# Altium schematic sheet NH1-1-Top.SchDoc: Top
size A3; SheetNumber: 1; SheetTotal: 1
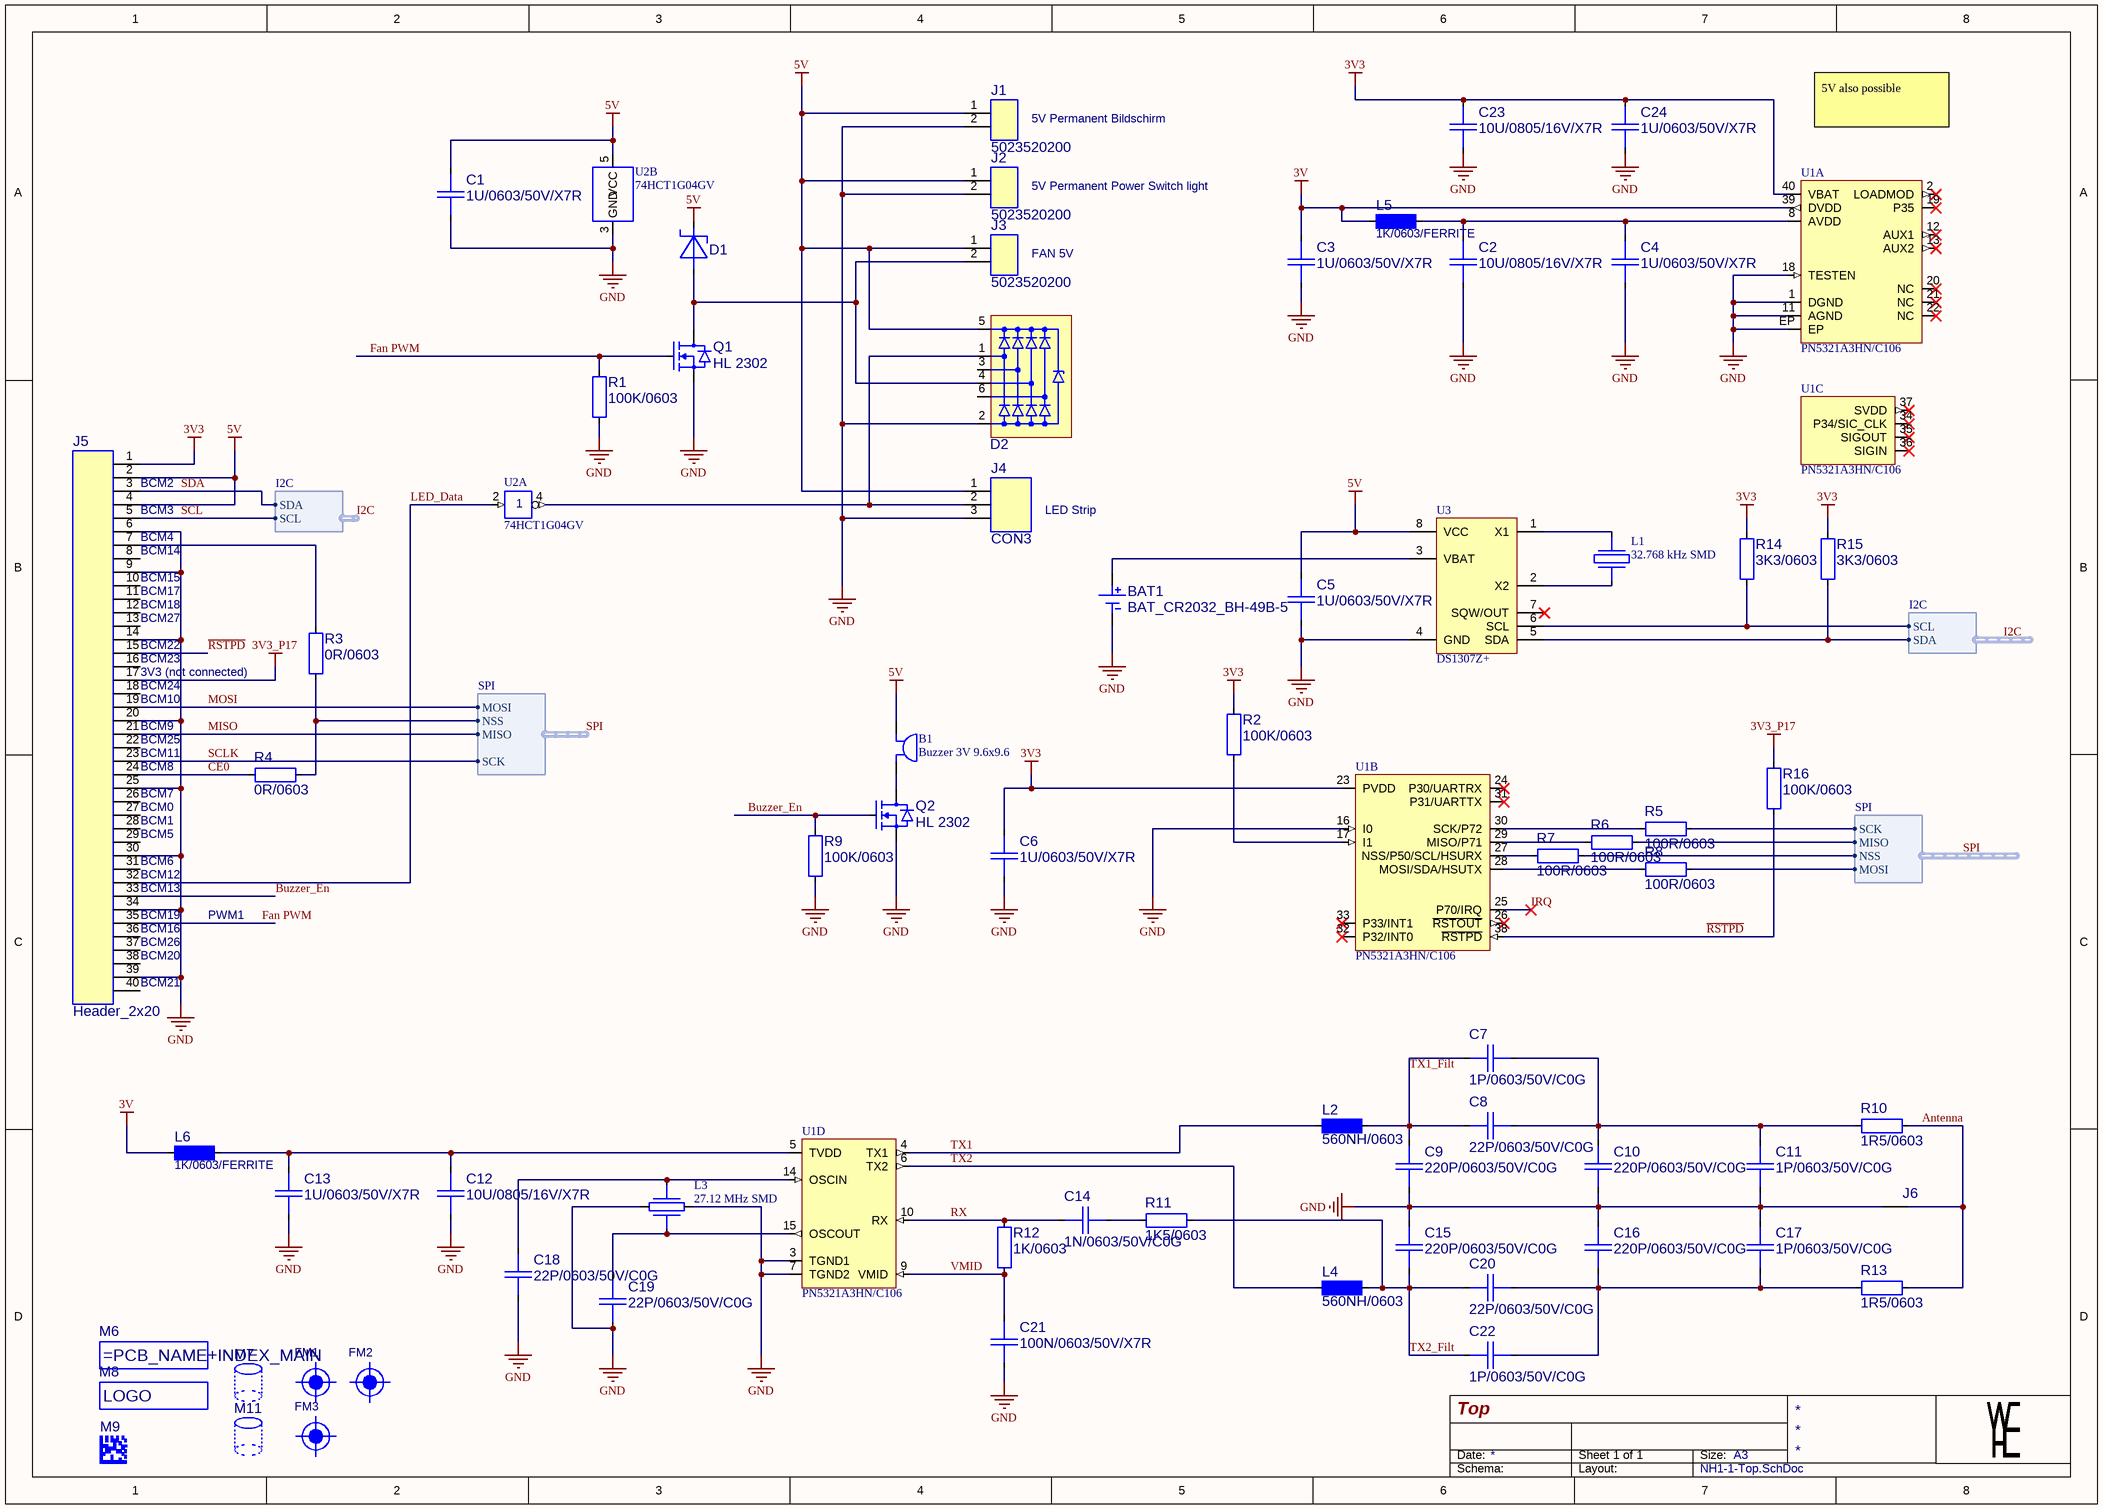
[diagram p0: NH1-1-Top.SchDoc]

## Parts
B1  Buzzer 3V 9.6x9.6  [BUZ970X970X500]
BAT1  BAT_CR2032_BH-49B-5  [BAT_CR2032_BH-49B-5]
C1  1U/0603/50V/X7R  [CAP0603_X7R]
C2  10U/0805/16V/X7R  [CAP0805_X7R]
C3  1U/0603/50V/X7R  [CAP0603_X7R]
C4  1U/0603/50V/X7R  [CAP0603_X7R]
C5  1U/0603/50V/X7R  [CAP0603_X7R]
C6  1U/0603/50V/X7R  [CAP0603_X7R]
C7  1P/0603/50V/C0G  [CAP0603_C0G]
C8  22P/0603/50V/C0G  [CAP0603_C0G]
C9  220P/0603/50V/C0G  [CAP0603_C0G]
C10  220P/0603/50V/C0G  [CAP0603_C0G]
C11  1P/0603/50V/C0G  [CAP0603_C0G]
C12  10U/0805/16V/X7R  [CAP0805_X7R]
C13  1U/0603/50V/X7R  [CAP0603_X7R]
C14  1N/0603/50V/C0G  [CAP0603_C0G]
C15  220P/0603/50V/C0G  [CAP0603_C0G]
C16  220P/0603/50V/C0G  [CAP0603_C0G]
C17  1P/0603/50V/C0G  [CAP0603_C0G]
C18  22P/0603/50V/C0G  [CAP0603_C0G]
C19  22P/0603/50V/C0G  [CAP0603_C0G]
C20  22P/0603/50V/C0G  [CAP0603_C0G]
C21  100N/0603/50V/X7R  [CAP0603_X7R]
C22  1P/0603/50V/C0G  [CAP0603_C0G]
C23  10U/0805/16V/X7R  [CAP0805_X7R]
C24  1U/0603/50V/X7R  [CAP0603_X7R]
D1  B5819W SL  [SOD3718X125]  (value not drawn)
D2  PRTR5V0U4D  [SOT2395P280X125-6-NW]  (value not drawn)
FM1  Fidu  [FIDU-1MM]  (value not drawn)  (no BOM)
FM2  Fidu  [FIDU-1MM]  (value not drawn)  (no BOM)
FM3  Fidu  [FIDU-1MM]  (value not drawn)  (no BOM)
J1  5023520200  [5023520200]
J2  5023520200  [5023520200]
J3  5023520200  [5023520200]
J4  CON3  [5023520300]
J5  Header_2x20  [HEAD_254_2X20]
J6  NETTIE_025x050  [NETTIE_025x050]  (value not drawn)  (no BOM)
L1  32.768 kHz SMD  [CYSMD550P380X800X254]
L2  560NH/0603  [IND0603]
L3  27.12 MHz SMD  [CYSMD220P340X270X080]
L4  560NH/0603  [IND0603]
L5  1K/0603/FERRITE  [FB0603]
L6  1K/0603/FERRITE  [FB0603]
M6  PCB NAME  [PCB-NAME-5MM-LEFT]  (value not drawn)
M7  Tooling JLC  [TOOLING-JLC]  (value not drawn)
M8  LOGO WHE  [LOGO-WHE-20MM]  (value not drawn)
M9  SERIAL 2D  [SERIAL-2D-10MM-RESTRICT]  (value not drawn)
M11  Tooling JLC  [TOOLING-JLC]  (value not drawn)
Q1  HL 2302  [SOT2395P280X125-3-SE]
Q2  HL 2302  [SOT2395P280X125-3-SE]
R1  100K/0603  [R0603-0.40-WW]
R2  100K/0603  [R0603-0.40-WW]
R3  0R/0603  [R0603-0.40-WW]
R4  0R/0603  [R0603-0.40-WW]
R5  100R/0603  [R0603-0.40-WW]
R6  100R/0603  [R0603-0.40-WW]
R7  100R/0603  [R0603-0.40-WW]
R8  100R/0603  [R0603-0.40-WW]
R9  100K/0603  [R0603-0.40-WW]
R10  1R5/0603  [R0603-0.40-WW]
R11  1K5/0603  [R0603-0.40-WW]
R12  1K/0603  [R0603-0.40-WW]
R13  1R5/0603  [R0603-0.40-WW]
R14  3K3/0603  [R0603-0.40-WW]
R15  3K3/0603  [R0603-0.40-WW]
R16  100K/0603  [R0603-0.40-WW]
U1  PN5321A3HN/C106  [QFN050P600X600X085-40-TH410X410]  (parts A,B,C,D of 4)
U2  74HCT1G04GV  [SOT2395P280X125-5-NW]  (parts A,B of 2)
U3  DS1307Z+  [SOP127P600X155-8-NW]

## Harnesses
SPI: SCK, MISO, NSS, MOSI
I2C: SCL, SDA

## Nets
3V: C3.1 L5.1 L6.1 U1.39(DVDD)
3V3: C6.1 C23.2 C24.1 J5.1 R2.1 R14.1 R15.1 U1.23(PVDD) U1.40(VBAT)
3V3_P17: J5.17 R16.1
5V: B1.1(+) C1.1 C5.1 D1.1(C) D2.5 J1.1 J2.1 J3.1 J4.1 J5.2 J5.4 U2.5(VCC) U3.8(VCC)
GND: BAT1.2(-) C1.2 C2.2 C3.2 C4.2 C5.2 C6.2 C9.2 C10.1 C11.1 C12.2 C13.2 C15.1 C16.2 C17.2 C18.2 C19.2 C21.2 C23.1 C24.2 D2.2 J1.2 J2.2 J4.3 J5.6 J5.9 J5.14 J5.20 J5.25 J5.30 J5.34 J5.39 J6.2 L3.2(GND) L3.4(GND) Q1.2(SOURCE) Q2.2(SOURCE) R1.2 R9.2 U1.1(DGND) U1.3(TGND1) U1.7(TGND2) U1.11(AGND) U1.16(I0) U1.18(TESTEN) U1.EP U2.3(GND) U3.4(GND)
Antenna: J6.1 R10.2 R13.2
Buzzer_En: J5.33 Q2.1(GATE) R9.1
CE0: J5.24 R4.1
Fan PWM: J5.35 Q1.1(GATE) R1.1
IRQ: U1.25(P70/IRQ)
LED_Data: J5.32 U2.2(A)
MISO: J5.21 R6.2 ; harness SPI.MISO
MOSI: J5.19 R8.2 ; harness SPI.MOSI
~{RSTPD}: J5.15 R16.2 U1.38(~{RSTPD})
RX: C14.1 R12.1 U1.10(RX)
SCL: J5.5 R14.2 U3.6(SCL) ; harness I2C.SCL  [project net I2C.SCL]
SCLK: J5.23 R5.2 ; harness SPI.SCK
SDA: J5.3 R15.2 U3.5(SDA) ; harness I2C.SDA  [project net I2C.SDA]
SPI.NSS: R3.1 R4.2 R7.2 ; harness SPI.NSS
TX1: L2.1 U1.4(TX1)
TX1_Filt: C7.1 C8.1 C9.1 L2.2
TX2: L4.1 U1.6(TX2)
TX2_Filt: C15.2 C20.1 C22.1 L4.2 R11.1
VMID: C21.1 R12.2 U1.9(VMID)
NetB1_2: B1.2(-) Q2.3(DRAIN)
NetBAT1_1: BAT1.1(+) U3.3(VBAT)
NetC2_1: C2.1 C4.1 L5.2 U1.8(AVDD)
NetC7_2: C7.2 C8.2 C10.2 C11.2 R10.1
NetC12_1: C12.1 C13.1 L6.2 U1.5(TVDD)
NetC14_2: C14.2 R11.2
NetC16_1: C16.1 C17.1 C20.2 C22.2 R13.1
NetC18_1: C18.1 L3.1 U1.14(OSCIN)
NetC19_1: C19.1 L3.3 U1.15(OSCOUT)
NetD1_2: D1.2(A) D2.4 J3.2 Q1.3(DRAIN)
NetD2_1: D2.1 J4.2 U2.4(Y)
NetJ5_7: J5.7 R3.2
NetL1_1: L1.1 U3.1(X1)
NetL1_4: L1.4 U3.2(X2)
NetR2_2: R2.2 U1.17(I1)
NetR5_1: R5.1 U1.30(SCK/P72)
NetR6_1: R6.1 U1.29(MISO/P71)
NetR7_1: R7.1 U1.27(NSS/P50/SCL/HSURX)
NetR8_1: R8.1 U1.28(MOSI/SDA/HSUTX)

Not connected (* = marked no-connect by the designer): D2 3 6; J5 8 10 11 12 13 16 18 22 26 27 28 29 31 36 37 38 40; U1 2(LOADMOD)* 12(AUX1)* 13(AUX2)* 19(P35)* 20(NC)* 21(NC)* 22(NC)* 24(P30/UARTRX)* 26(~{RSTOUT})* 31(P31/UARTTX)* 32(P32/INT0)* 33(P33/INT1)* 34(P34/SIC_CLK)* 35(SIGOUT)* 36(SIGIN)* 37(SVDD)*; U3 7(SQW/OUT)*

## Notes on the sheet
- (near J1) 5V Permanent Bildschirm
- 5V also possible
- (near J2) 5V Permanent Power Switch light
- (near J3) FAN 5V
- (near J5) BCM2
- (near J5) BCM3
- LED Strip
- (near J5) BCM4
- (near J5) BCM14
- (near J5) BCM15
- (near J5) BCM17
- (near J5) BCM18
- (near J5) BCM22
- (near J5) BCM27
- (near J5) BCM10
- (near J5) BCM23
- (near J5) BCM24
- (near J5) 3V3 (not connected)
- (near J5) BCM8
- (near J5) BCM9
- (near J5) BCM11
- (near J5) BCM25
- (near J5) BCM5
- (near J5) BCM7
- (near J5) BCM0
- (near J5) BCM1
- (near J5) BCM6
- (near J5) BCM12
- (near J5) BCM13
- (near J5) BCM19
- PWM1
- (near J5) BCM16
- (near J5) BCM20
- (near J5) BCM21
- (near J5) BCM26
- Date:
- Size:
- A3
- Schema:
- Layout:
- (in symbol 74HCT1G04GV, part A) 1

## Library data of the parts
B1 = Buzzer SMD: Buzzer Active 3V SMD; Manufacturer: Same Sky (Formerly CUI Devices); Manufacturer Part Number 1: CMI-9705-0380-SMT-TR; Part Number: Buzzer SMD; Manufacturer 1: Same Sky (Formerly CUI Devices); Supplier 1: Digi-Key; Supplier Part Number 1: 102-CMI-9705-0380-SMT-CT-ND; Manufacturer 3: FUET; Manufacturer Part Number 3: FUET FUET-9650B-3V; Supplier 3: LCSC; Supplier Part Number 3: C391032; HelpURL: https://www.sameskydevices.com/product/resource/cmi-9705-0380-smt-tr.pdf
BAT1 = BAT_CR2032_BH-49B-5: BH-49B-5 CR2032 Battery Holder; Manufacturer: Generic; Manufacturer 1: Adam Tech; Part Number: BAT_CR2032_BH-49B-5; HelpURL: https://app.adam-tech.com/products/download/data_sheet/197073/bh-49b-5-data-sheet.pdf; Manufacturer Part Number 1: BH-49B-5; Supplier 1: Digi-Key; Supplier Part Number 1: 2057-BH-49B-5-ND; Manufacturer 3: Lian Xin Technology; Manufacturer Part Number 3: XDCR-2032-603; Supplier 3: LCSC; Supplier Part Number 3: C7498148
C1 C3-C6 C13 C24 = 1U/0603/50V/X7R: CAP SM 0603 1.0uF 50V X7R; Manufacturer: GENERIC; Manufacturer 1: YAGEO; Manufacturer Part Number 1: CC0603KRX7R9BB105; Absolute Value: 1E-6; Eurocircuits GPN: GPC0603105; Part Number: 1U/0603/50V/X7R; Package: 0603; Value: 1.0uF; HelpURL: https://www.yageo.com/upload/media/product/app/datasheet/mlcc/upy-gphc_x7r_6_3v-to-250v.pdf; Supplier 1: Digi-Key; Supplier Part Number 1: 311-2082-1-ND
C2 C12 C23 = 10U/0805/16V/X7R: CAP SM 0805 10uF 16V X7R; Manufacturer: GENERIC; Manufacturer 1: Cal-Chip Electronics, Inc.; Manufacturer Part Number 1: GMC21X7R106K16NT; Absolute Value: 1E-5; Eurocircuits GPN: GPN0805106-16; Part Number: 10U/0805/16V/X7R; Package: 0805; Value: 10uF; HelpURL: https://88ce57.p3cdn1.secureserver.net/wp-content/uploads/2023/01/gmc_series-2.pdf; Supplier 1: Digi-Key; Supplier Part Number 1: 4713-GMC21X7R106K16NTCT-ND; Manufacturer 2: Samsung Electro-Mechanics; Manufacturer Part Number 2: CL21B106KOQNNNE; Supplier 2: Digi-Key; Supplier Part Number 2: 1276-2872-1-ND; Supplier 3: LCSC; Supplier Part Number 3: C95841; JLC Type: Basic
C7 C11 C17 C22 = 1P/0603/50V/C0G: CAP SM 0603 1.0pF 50V C0G; Manufacturer: GENERIC; Manufacturer 1: YAGEO; Manufacturer Part Number 1: CC0603CRNPO9BN1R0; Absolute Value: 1E-12; Eurocircuits GPN: GPC06031R0-C0G; Part Number: 1P/0603/50V/C0G; Package: 0603; Value: 1.0pF; HelpURL: https://www.yageo.com/upload/media/product/productsearch/datasheet/mlcc/UPY-GP_NP0_16V-to-50V_18.pdf; Supplier 1: Digi-Key; Supplier Part Number 1: 311-1049-1-ND; Manufacturer 2: YAGEO; Manufacturer Part Number 2: CC0603BRNPO9BN1R0; Supplier 2: Digi-Key; Supplier Part Number 2: 311-3346-1-ND
C8 C18-C20 = 22P/0603/50V/C0G: CAP SM 0603 22pF 50V C0G; Manufacturer: GENERIC; Manufacturer 1: YAGEO; Manufacturer Part Number 1: CC0603JRNPO9BN220; Absolute Value: 2.2E-11; Eurocircuits GPN: GPC0603220-C0G; Part Number: 22P/0603/50V/C0G; Package: 0603; Value: 22pF; HelpURL: https://www.yageo.com/upload/media/product/productsearch/datasheet/mlcc/UPY-GP_NP0_16V-to-50V_18.pdf; Supplier 1: Digi-Key; Supplier Part Number 1: 311-1062-1-ND; Manufacturer 2: YAGEO; Manufacturer Part Number 2: CC0603KRNPO9BN220; Supplier 2: Digi-Key; Supplier Part Number 2: 311-4030-1-ND
C9 C10 C15 C16 = 220P/0603/50V/C0G: CAP SM 0603 220pF 50V C0G; Manufacturer: GENERIC; Manufacturer 1: YAGEO; Manufacturer Part Number 1: CC0603JRNPO9BN221; Absolute Value: 2.2E-10; Eurocircuits GPN: GPC0603221-C0G; Part Number: 220P/0603/50V/C0G; Package: 0603; Value: 220pF; HelpURL: https://www.yageo.com/upload/media/product/productsearch/datasheet/mlcc/UPY-GP_NP0_16V-to-50V_18.pdf; Supplier 1: Digi-Key; Supplier Part Number 1: 311-1073-1-ND; Manufacturer 2: YAGEO; Manufacturer Part Number 2: CC0603KRNPO9BN221; Supplier 2: Digi-Key; Supplier Part Number 2: 311-4031-1-ND
C14 = 1N/0603/50V/C0G: CAP SM 0603 1.0nF 50V C0G; Manufacturer: GENERIC; Manufacturer 1: YAGEO; Manufacturer Part Number 1: CC0603JRNPO9BN102; Absolute Value: 1E-9; Eurocircuits GPN: GPC0603102-C0G; Part Number: 1N/0603/50V/C0G; Package: 0603; Value: 1.0nF; HelpURL: https://www.yageo.com/upload/media/product/productsearch/datasheet/mlcc/UPY-GP_NP0_16V-to-50V_18.pdf; Supplier 1: Digi-Key; Supplier Part Number 1: 311-1423-1-ND; Manufacturer 2: YAGEO; Manufacturer Part Number 2: CC0603KRNPO9BN102; Supplier 2: Digi-Key; Supplier Part Number 2: 311-4026-1-ND
C21 = 100N/0603/50V/X7R: CAP SM 0603 100nF 50V X7R; Manufacturer: GENERIC; Manufacturer 1: YAGEO; Manufacturer Part Number 1: CC0603KPX7R9BB104; Absolute Value: 1E-7; Eurocircuits GPN: GPC0603104; Part Number: 100N/0603/50V/X7R; Package: 0603; Value: 100nF; HelpURL: https://www.yageo.com/upload/media/product/app/datasheet/mlcc/upy-gphc_x7r_6_3v-to-250v.pdf; Supplier 1: Digi-Key; Supplier Part Number 1: 311-3567-1-ND; Manufacturer 2: YAGEO; Manufacturer Part Number 2: CC0603MRX7R9BB104; Supplier 2: Digi-Key; Supplier Part Number 2: 311-4110-1-ND; Supplier 3: LCSC; Supplier Part Number 3: C14663; JLC Type: Basic
D1 = B5819W SL: 40V 600mV@1A 1A SOD-123 Schottky Barrier Diodes; Manufacturer: GENERIC; Manufacturer 1: SMC Diode Solutions; Part Number: B5819W SL; Package: SOD-123; Value: B5819W SL; Absolute Value: 40V; HelpURL: https://datasheet.lcsc.com/lcsc/2304140030_Jiangsu-Changjing-Electronics-Technology-Co---Ltd--B5819W-SL_C8598.pdf; Manufacturer Part Number 1: B5819WSL; Supplier 1: Digikey; Supplier Part Number 1: 1655-B5819WSLCT-ND; Manufacturer 3: Jiangsu Changjing Electronics Technology Co., Ltd.; Manufacturer Part Number 3: B5819W SL; Supplier 3: LCSC; Supplier Part Number 3: C8598; JLC Type: Basic
D2 = PRTR5V0U4D: quadruple rail-to-rail ESD protection 5V; Manufacturer: Nexperia; Manufacturer 1: Nexperia USA Inc.; Manufacturer Part Number 1: PRTR5V0U4D,125; Part Number: PRTR5V0U4D; Package: SC74 SOT-457; Value: PRTR5V0U4D; Absolute Value: 5V; HelpURL: https://assets.nexperia.com/documents/data-sheet/PRTR5V0U4D.pdf; Supplier 1: Digikey; Supplier Part Number 1: 1727-3890-1-ND
FM1-FM3 = Fidu_1mm: Fiducial 1mm; Manufacturer: NONE; Part Number: Fidu_1mm
J1-J3 = DuraClick_1x2_RA_SMD: DuraClik Wire-to-Board Header, Single Row, Right-Angle, 2 Circuits, Tin (Sn) Over Nickel, Natural; Manufacturer: Molex; Part Number: DuraClick_1x2_RA_SMD; HelpURL: https://www.molex.com/en-us/products/part-detail/5023520200; Manufacturer 1: Molex; Manufacturer Part Number 1: 5023520200; Supplier 1: Digi-Key; Supplier Part Number 1: WM7169CT-ND; Manufacturer 3: Molex; Manufacturer Part Number 3: 5023520200; Supplier 3: LCSC; Supplier Part Number 3: C114107
J4 = DuraClick_1x3_RA_SMD: DuraClik Wire-to-Board Header, Single Row, Right-Angle, 3 Circuits, Tin (Sn) Over Nickel, Natural; Manufacturer: Molex; Part Number: DuraClick_1x3_RA_SMD; HelpURL: https://www.molex.com/en-us/products/part-detail/5023520300; Manufacturer 1: Molex; Manufacturer Part Number 1: 5023520300; Supplier 1: Digi-Key; Supplier Part Number 1: WM10858CT-ND; Manufacturer 3: Molex; Manufacturer Part Number 3: 5023520300; Supplier 3: LCSC; Supplier Part Number 3: C412111
J5 = Header_2x20: Header 100 mil; Manufacturer: GENERIC; Manufacturer 1: 10129381-940002BLF; Manufacturer Part Number 1: Amphenol ICC (FCI); Part Number: Header_2x20; HelpURL: https://cdn.amphenol-cs.com/media/wysiwyg/files/drawing/10129381.pdf; Supplier 1: Digi-Key; Supplier Part Number 1: 10129381-940002BLF-ND
J6 = NETTIE_025x050: Manufacturer: NONE; Part Number: NETTIE_025x050
L1 = Crystal 32.768 kHz SMD: 32.768 kHz ±20ppm Quarze 12,5pF 4-SOJ, 5,50mm Raster; Manufacturer 1: EPSON; Manufacturer Part Number 1: MC-306 32.7680K-A0:ROHS; Part Number: Crystal 32.768 kHz SMD; HelpURL: https://support.epson.biz/td/api/doc_check.php?dl=brief_MC-306&lang=en; Supplier 1: Digi-Key; Supplier Part Number 1: SER2407CT-ND; Manufacturer 3: Seiko Epson; Manufacturer Part Number 3: Q13MC30610003; Supplier 3: LCSC; Supplier Part Number 3: C16320
L2 L4 = 560NH/0603: FIXED IND 560NH 150MA 900MOHM SM; Manufacturer: Bourns Inc.; Manufacturer Part Number 1: CS160808-R56K; Absolute Value: 5.6E-7; Part Number: 560NH/0603; Package: 603; Value: 560NH; HelpURL: https://www.bourns.com/docs/Product-Datasheets/CS160808.pdf; Manufacturer 1: Bourns Inc.; Supplier 1: Digi-Key; Supplier Part Number 1: CS160808-R56KCT-ND; Manufacturer 3: FH (Guangdong Fenghua Advanced Tech); Manufacturer Part Number 3: CMI160808VR56KT; Supplier 3: LCSC; Supplier Part Number 3: C139215
L3 = Crystal 27.12 MHz SMD: 27.12MHZ/10PF/10PPM; Manufacturer: Generic; Manufacturer 1: Würth Elektronik; Manufacturer Part Number 1: 830053099; Part Number: Crystal 27.12 MHz SMD; HelpURL: https://www.we-online.com/components/products/datasheet/830106246109.pdf; Supplier 1: Digi-Key; Supplier Part Number 1: 732-830053099CT-ND; Manufacturer 3: TOGNJING; Manufacturer Part Number 3: XTM32027120GT00351001; Supplier 3: LCSC; Supplier Part Number 3: C41383250
L5 L6 = 1K/0603/FERRITE: 1K@100MHz 800mA 0603 Ferrite; Manufacturer: GENERIC; Manufacturer 1: TDK Corporation; Manufacturer Part Number 1: MPZ1608S102ATD25; Value: 1K; Absolute Value: 1000; Part Number: 1K/0603/FERRITE; Package: 603; HelpURL: https://product.tdk.com/en/system/files?file=dam/doc/product/emc/emc/beads/catalog/beads_automotive_power_mpz1608_en.pdf; Supplier 1: Digi-Key; Supplier Part Number 1: 445-MPZ1608S102ATD25CT-ND; Manufacturer 3: TAI-TECH; Manufacturer Part Number 3: FCM1608KF-102T08; Supplier 3: LCSC; Supplier Part Number 3: C2880084
M6 = PCB NAME 5mm L: PCB name, 5mm text height, left-aligned; Manufacturer: NONE; Part Number: PCB NAME 5mm L
M7 M11 = Tooling JLC: Tooling hole for JLC (1.152mm); Manufacturer: NONE; Part Number: Tooling JLC
M8 = LOGO WHE 20MM: WHE logo, size 20mm; Manufacturer: NONE; Part Number: LOGO WHE 20MM
M9 = SERIAL 2D 10MM RESTRICT: 2D Serial number placeholder, Dotmatrix or QR, size: 10mm, restriction on top layer; Manufacturer: NONE; Part Number: SERIAL 2D 10MM RESTRICT
Q1 Q2 = HL 2302: N-Ch 20V Fast Switching MOSFETs; Manufacturer: GENERIC; Part Number: HL 2302; Package: SOT23; HelpURL: https://datasheet.lcsc.com/lcsc/2009171007_HUASHUO-HSS2302B_C518782.pdf; Manufacturer 2: FUXINSEMI; Manufacturer Part Number 2: SI2302; Supplier 2: LCSC; Supplier Part Number 2: C6807797; Manufacturer 3: HUASHUO; Manufacturer Part Number 3: HSS2302B; Supplier 3: LCSC; Supplier Part Number 3: C518782; JLC Type: Extended
R1 R2 R9 R16 = 100K/0603: RES SM 0603 100K; Manufacturer: GENERIC; Manufacturer 1: YAGEO; Manufacturer Part Number 1: RC0603FR-13100KL; Absolute Value: 100000; Eurocircuits GPN: GPR0603100K; Part Number: 100K/0603; Package: 0603; Value: 100K; HelpURL: https://www.yageo.com/upload/media/product/productsearch/datasheet/rchip/PYu-RC_Group_51_RoHS_L_12.pdf; Supplier 1: Digi-Key; Supplier Part Number 1: 13-RC0603FR-13100KLCT-ND; Manufacturer 2: YAGEO; Manufacturer Part Number 2: RC0603FR-10100KL; Supplier 2: Digi-Key; Supplier Part Number 2: 13-RC0603FR-10100KLCT-ND; Manufacturer 3: UNI-ROYAL(Uniroyal Elec); Manufacturer Part Number 3: 0603WAF1003T5E; Supplier 3: LCSC; Supplier Part Number 3: C25803; JLC Type: Basic
R3 R4 = 0R/0603: RES SM 0603 0R; Manufacturer: GENERIC; Manufacturer 1: YAGEO; Manufacturer Part Number 1: RC0603FR-070RL; Absolute Value: 0; Eurocircuits GPN: GPR06030R; Part Number: 0R/0603; Package: 0603; Value: 0R; HelpURL: https://www.yageo.com/upload/media/product/app/datasheet/rchip/pyu-rc_group_51_rohs_l.pdf; Supplier 1: Digi-Key; Supplier Part Number 1: 311-0.0HRCT-ND; Manufacturer 2: YAGEO; Manufacturer Part Number 2: RC0603FR-130RL; Supplier 2: Digi-Key; Supplier Part Number 2: 13-RC0603FR-130RLCT-ND; Manufacturer 3: UNI-ROYAL(Uniroyal Elec); Manufacturer Part Number 3: 0603WAF0000T5E; Supplier 3: LCSC; Supplier Part Number 3: C21189; JLC Type: Basic
R5-R8 = 100R/0603: RES SM 0603 100R; Manufacturer: GENERIC; Manufacturer 1: YAGEO; Manufacturer Part Number 1: RC0603FR-13100RL; Absolute Value: 100; Eurocircuits GPN: GPR0603100R; Part Number: 100R/0603; Package: 0603; Value: 100R; HelpURL: https://www.yageo.com/upload/media/product/productsearch/datasheet/rchip/PYu-RC_Group_51_RoHS_L_12.pdf; Supplier 1: Digi-Key; Supplier Part Number 1: 13-RC0603FR-13100RLCT-ND; Manufacturer 2: YAGEO; Manufacturer Part Number 2: RC0603FR-10100RL; Supplier 2: Digi-Key; Supplier Part Number 2: 13-RC0603FR-10100RLCT-ND
R10 R13 = 1R5/0603: RES SM 0603 1R5; Manufacturer: GENERIC; Manufacturer 1: YAGEO; Manufacturer Part Number 1: RC0603FR-131R5L; Absolute Value: 1.5; Eurocircuits GPN: GPR06031R5; Part Number: 1R5/0603; Package: 0603; Value: 1R5; HelpURL: https://www.yageo.com/upload/media/product/productsearch/datasheet/rchip/PYu-RC_Group_51_RoHS_L_12.pdf; Supplier 1: Digi-Key; Supplier Part Number 1: 13-RC0603FR-131R5LCT-ND; Manufacturer 2: YAGEO; Manufacturer Part Number 2: RC0603FR-101R5L; Supplier 2: Digi-Key; Supplier Part Number 2: 13-RC0603FR-101R5LCT-ND
R11 = 1K5/0603: RES SM 0603 1K5; Manufacturer: GENERIC; Manufacturer 1: YAGEO; Manufacturer Part Number 1: RC0603FR-131K5L; Absolute Value: 1500; Eurocircuits GPN: GPR06031K5; Part Number: 1K5/0603; Package: 0603; Value: 1K5; HelpURL: https://www.yageo.com/upload/media/product/app/datasheet/rchip/pyu-rc_group_51_rohs_l.pdf; Supplier 1: Digi-Key; Supplier Part Number 1: 13-RC0603FR-131K5LCT-ND; Manufacturer 2: YAGEO; Manufacturer Part Number 2: RC0603FR-101K5L; Supplier 2: Digi-Key; Supplier Part Number 2: 13-RC0603FR-101K5LCT-ND; Manufacturer 3: UNI-ROYAL(Uniroyal Elec); Manufacturer Part Number 3: 0603WAF1501T5E; Supplier 3: LCSC; Supplier Part Number 3: C22843; JLC Type: Basic
R12 = 1K/0603: RES SM 0603 1K; Manufacturer: GENERIC; Manufacturer 1: YAGEO; Manufacturer Part Number 1: RC0603FR-131KL; Absolute Value: 1000; Eurocircuits GPN: GPR06031K; Part Number: 1K/0603; Package: 0603; Value: 1K; HelpURL: https://www.yageo.com/upload/media/product/app/datasheet/rchip/pyu-rc_group_51_rohs_l.pdf; Supplier 1: Digi-Key; Supplier Part Number 1: 13-RC0603FR-131KLCT-ND; Manufacturer 2: YAGEO; Manufacturer Part Number 2: RC0603FR-101KL; Supplier 2: Digi-Key; Supplier Part Number 2: 13-RC0603FR-101KLCT-ND; Manufacturer 3: UNI-ROYAL(Uniroyal Elec); Manufacturer Part Number 3: 0603WAF1001T5E; Supplier 3: LCSC; Supplier Part Number 3: C21190; JLC Type: Basic
R14 R15 = 3K3/0603: RES SM 0603 3K3; Manufacturer: GENERIC; Manufacturer 1: YAGEO; Manufacturer Part Number 1: RC0603FR-133K3L; Absolute Value: 3300; Eurocircuits GPN: GPR06033K3; Part Number: 3K3/0603; Package: 0603; Value: 3K3; HelpURL: https://www.yageo.com/upload/media/product/app/datasheet/rchip/pyu-rc_group_51_rohs_l.pdf; Supplier 1: Digi-Key; Supplier Part Number 1: 13-RC0603FR-133K3LCT-ND; Manufacturer 2: YAGEO; Manufacturer Part Number 2: RC0603FR-103K3L; Supplier 2: Digi-Key; Supplier Part Number 2: 13-RC0603FR-103K3LCT-ND
U1 = PN5321A3HN/C106: RFID-Reader/Transponder IC 13,56MHz FeliCa, ISO 14443, MIFARE, NFC I2C, SPI, UART 2,7V bis 5,5V 40-VFQFN mit freiliegendem Pad; Manufacturer 1: NXP USA Inc.; Manufacturer Part Number 1: PN5321A3HN/C106,55; HelpURL: https://www.nxp.com/docs/en/nxp/data-sheets/PN532_C1.pdf; Manufacturer 3: NXP USA Inc.; Manufacturer: NXP USA Inc.; Manufacturer Part Number 3: PN5321A3HN/C106,55; Package: VFQFN-40; Part Number: PN5321A3HN/C106; Supplier 1: Digi-Key; Supplier 3: LCSC; Supplier Part Number 1: 568-13228-ND; Supplier Part Number 3: C28925
U2 = 74HCT1G04GV: Single inverter, SOT23-5; Manufacturer: Nexperia; Manufacturer 1: Nexperia USA Inc.; Manufacturer Part Number 1: 74HCT1G04GV,125; Part Number: 74HCT1G04GV; Package: SOT23-5; HelpURL: https://assets.nexperia.com/documents/data-sheet/74HC_HCT1G04.pdf; Supplier 1: Digi-Key; Supplier Part Number 1: 1727-6925-1-ND; Manufacturer 3: Nexperia; Manufacturer Part Number 3: 74HCT1G04GV,125; Supplier 3: LCSC; Supplier Part Number 3: C12503; JLC Type: Extended
U3 = DS1307Z+: IC RTC CLK/CALENDAR I2C 8SOIC; Manufacturer: Analog Devices Inc./Maxim Integrated; Manufacturer Part Number 1: DS1307Z+T&R; Part Number: DS1307Z+; Package: PDIP; HelpURL: https://www.analog.com/media/en/technical-documentation/data-sheets/ds1307.pdf; Manufacturer 1: Analog Devices Inc./Maxim Integrated; Supplier 1: Digi-Key; Supplier Part Number 1: DS1307Z+T&RCT-ND; Manufacturer 2: Analog Devices Inc./Maxim Integrated; Manufacturer Part Number 2: DS1307Z+; Supplier 2: Digi-Key; Supplier Part Number 2: DS1307Z+-ND; Manufacturer 3: Analog Devices Inc./Maxim Integrated; Manufacturer Part Number 3: DS1307Z+; Supplier 3: LCSC; Supplier Part Number 3: C1520446